# Altium schematic sheet [03] GSM_GPRS_GPS.SchDoc: GSM_GPRS_GPS
size A4
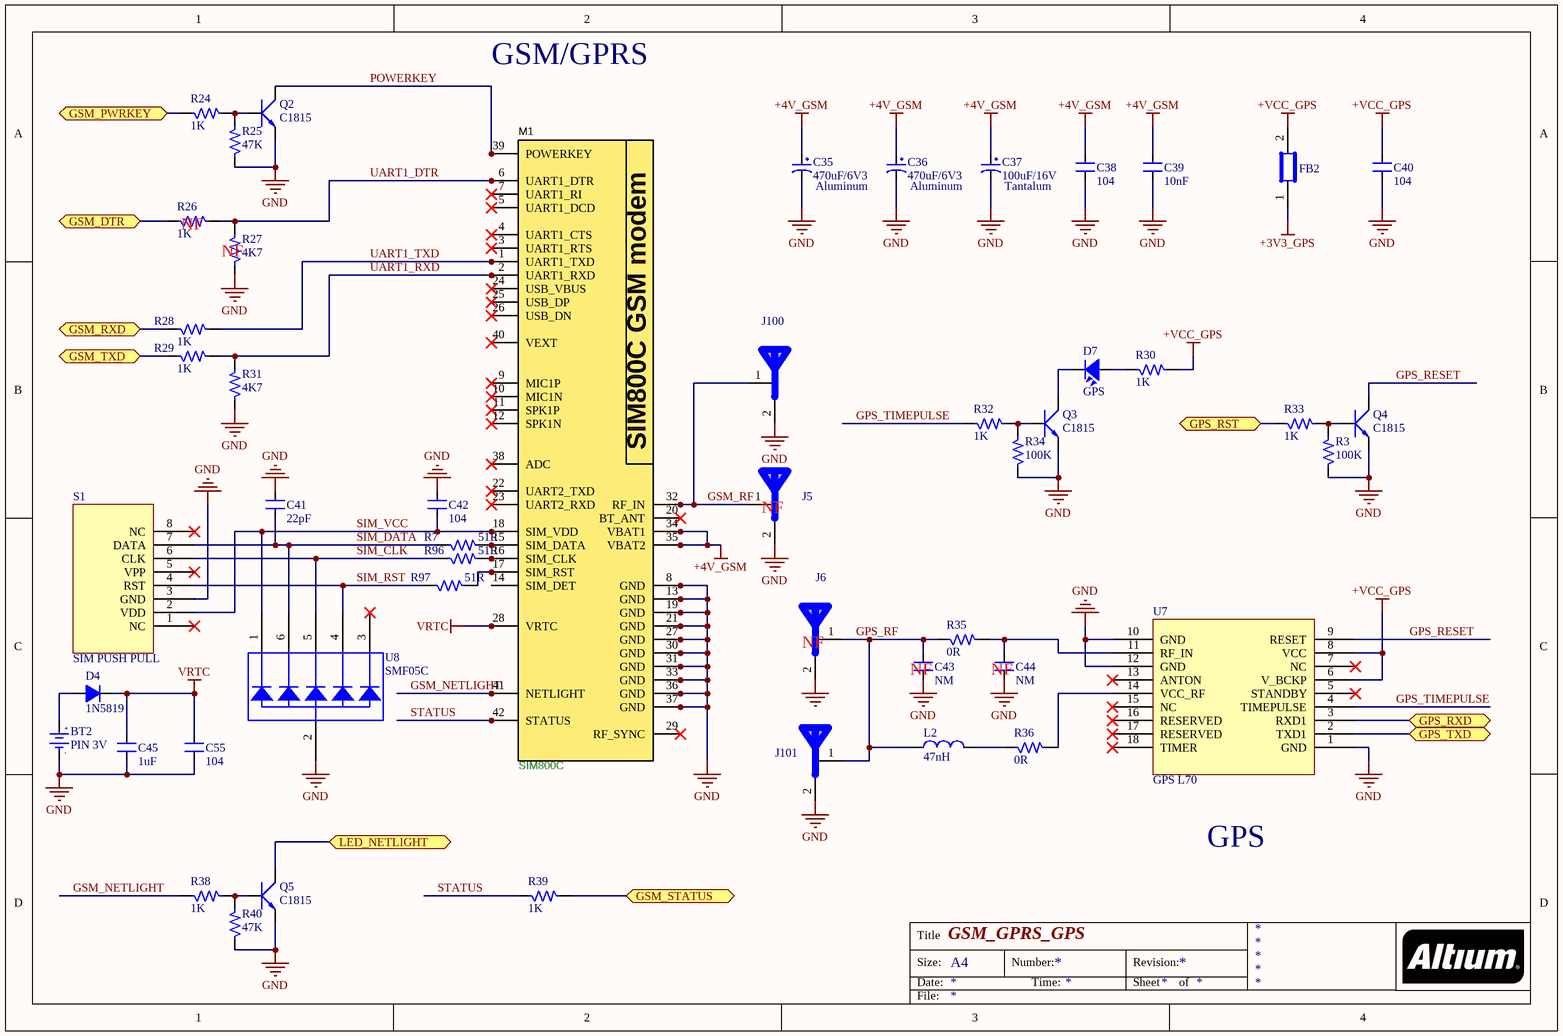
[diagram p0: [03] GSM_GPRS_GPS.SchDoc]

## Parts
BT2  PIN 3V  [PIN3V_mini]
C35  470uF/6V3  [C_Alu_6.3x7.7]
C36  470uF/6V3  [C_Alu_6.3x7.7]
C37  100uF/16V  [C_7343_40]
C38  104  [C0603 SMT]
C39  10nF  [C0603 SMT]
C40  104  [C0603 SMT]
C41  22pF  [C0603 SMT]
C42  104  [C0603 SMT]
C43  NM  [C0603 SMT]
C44  NM  [C0603 SMT]
C45  1uF  [C0603 SMT]
C55  104  [C0603 SMT]
D4  1N5819  [SOD123]
D7  GPS  [Led_0603_RED]
FB2  BLM21PG600SN1D  [R0805]  (value not drawn)
J5  GSM  [Antenna-IPEX]  (value not drawn)
J6  GPS  [Antenna-IPEX]  (value not drawn)
J100  GPS_ANTENNA  [Antenna-MCX5.08-H5]  (value not drawn)
J101  GPS_ANTENNA  [Antenna-MCX5.08-H5]  (value not drawn)
L2  47nH  [C0805]
M1  SIM800C  [SIM800C]
Q2  C1815  [SOT23B]
Q3  C1815  [SOT23B]
Q4  C1815  [SOT23B]
Q5  C1815  [SOT23B]
R3  100K  [R0603 -SMT]
R7  51R  [R0603 -SMT]
R24  1K  [R0603 -SMT]
R25  47K  [R0603 -SMT]
R26  1K  [R0603 -SMT]
R27  4K7  [R0603 -SMT]
R28  1K  [R0603 -SMT]
R29  1K  [R0603 -SMT]
R30  1K  [R0603 -SMT]
R31  4K7  [R0603 -SMT]
R32  1K  [R0603 -SMT]
R33  1K  [R0603 -SMT]
R34  100K  [R0603 -SMT]
R35  0R  [R0603 -SMT]
R36  0R  [R0603 -SMT]
R38  1K  [R0603 -SMT]
R39  1K  [R0603 -SMT]
R40  47K  [R0603 -SMT]
R96  51R  [R0603 -SMT]
R97  51R  [R0603 -SMT]
S1  SIM PUSH PULL  [Sim Push Push]
U7  GPS L70  [GPS L70]
U8  SMF05C  [SOT_363_6]

## Ports
GPS_RST, GPS_RXD, GPS_TXD, GSM_DTR, GSM_PWRKEY, GSM_RXD, GSM_STATUS, GSM_TXD, LED_NETLIGHT

## Nets
+3V3_GPS: FB2.1
+4V_GSM: C35.1 C36.1 C37.1 C38.1 C39.1 M1.34(VBAT1) M1.35(VBAT2)
+VCC_GPS: C40.2 FB2.2 R30.2 U7.6(V_BCKP) U7.8(VCC)
GND: BT2.2(GND) C35.2 C36.2 C37.2 C38.2 C39.2 C40.1 C41.2 C42.2 C43.1 C44.1 C45.1 C55.1 J5.2(GND) J6.2(GND) J100.2(GND) J101.2(GND) M1.8(GND) M1.13(GND) M1.19(GND) M1.21(GND) M1.27(GND) M1.30(GND) M1.31(GND) M1.33(GND) M1.36(GND) M1.37(GND) Q2.1(E) Q3.1(E) Q4.1(E) Q5.1(E) R3.1 R25.1 R27.1 R31.1 R34.1 R40.1 S1.3(GND) U7.1(GND) U7.10(GND) U7.12(GND) U8.2(A)
VRTC: C45.2 C55.2 D4.2(K) M1.28(VRTC)
GPS_RESET: Q4.2(C) U7.9(RESET)
GPS_RF: C43.2 J6.1(GND) J101.1(GND) L2.1 R35.1
GPS_RST: R33.1 ; port GPS_RST
GPS_RXD: U7.3(RXD1) ; port GPS_RXD
GPS_TIMEPULSE: R32.1 U7.4(TIMEPULSE)
GPS_TXD: U7.2(TXD1) ; port GPS_TXD
GSM_DTR: R26.1 ; port GSM_DTR
GSM_NETLIGHT: M1.41(NETLIGHT) R38.1
GSM_PWRKEY: R24.1 ; port GSM_PWRKEY
GSM_RF: J5.1(GND) J100.1(GND) M1.32(RF_IN)
GSM_RXD: R28.1 ; port GSM_RXD
GSM_STATUS: R39.2 ; port GSM_STATUS
GSM_TXD: R29.1 ; port GSM_TXD
LED_NETLIGHT: Q5.2(C) ; port LED_NETLIGHT
POWERKEY: M1.39(POWERKEY) Q2.2(C)
SIM_CLK: R96.1 S1.6(CLK) U8.5(K4)
SIM_DATA: C41.1 R7.1 S1.7(DATA) U8.6(K5)
SIM_RST: R97.1 S1.4(RST) U8.4(K3)
SIM_VCC: C42.1 M1.18(SIM_VDD) S1.2(VDD) U8.1(K1)
STATUS: M1.42(STATUS) R39.1
UART1_DTR: M1.6(UART1_DTR) R26.2 R27.2
UART1_RXD: M1.2(UART1_RXD) R29.2 R31.2
UART1_TXD: M1.1(UART1_TXD) R28.2
NetBT2_1: BT2.1(+3V) D4.1(A)
NetC44_2: C44.2 R35.2 U7.11(RF_IN)
NetD7_1: D7.1 R30.1
NetD7_2: D7.2 Q3.2(C)
NetL2_2: L2.2 R36.1
NetM1_15: M1.15(SIM_DATA) R7.2
NetM1_16: M1.16(SIM_CLK) R96.2
NetM1_17: M1.17(SIM_RST) R97.2
NetQ2_3: Q2.3(B) R24.2 R25.2
NetQ3_3: Q3.3(B) R32.2 R34.2
NetQ4_3: Q4.3(B) R3.2 R33.2
NetQ5_3: Q5.3(B) R38.2 R40.2
NetR36_2: R36.2 U7.14(VCC_RF)

Not connected (* = marked no-connect by the designer): M1 3(UART1_RTS)* 4(UART1_CTS)* 5(UART1_DCD)* 7(UART1_RI)* 9(MIC1P)* 10(MIC1N)* 11(SPK1P)* 12(SPK1N)* 14(SIM_DET) 20(BT_ANT)* 22(UART2_TXD)* 23(UART2_RXD)* 24(USB_VBUS)* 25(USB_DP)* 26(USB_DN)* 29(RF_SYNC)* 38(ADC)* 40(VEXT)*; S1 1(NC)* 5(VPP)* 8(NC)*; U7 5(STANDBY)* 7(NC)* 13(ANTON)* 15(NC)* 16(RESERVED)* 17(RESERVED)* 18(TIMER)*; U8 3(K2)*

## Notes on the sheet
- GSM/GPRS
- (near R26) NF
- (near C35) Aluminum
- (near C36) Aluminum
- (near C37) Tantalum
- (near R27) NF
- (near J5) NF
- (near J6) NF
- (near C43) NF
- (near C44) NF
- GPS
- Title
- Size:
- Date:
- A4
- Number:
- Time:
- Revision:
- Sheet
- of
- File:
- (in symbol PIN 3V) +; -
- (in symbol SIM800C) SIM800C GSM modem

## Library data of the parts
BT2 = PIN 3V: Battery 3VDC; Value: PIN 3V
C35 C36 = C-Alu-Tantalum: Cap Aluminum; Value: 10uF/50V; Description 1: 10 => 220uF/6,3V/10V - 10uF => 100uF/16V; Description 2: 0,1uF => 33uF/50V - 10uF => 22uF/63V; Description 3: 0,47uF => 10uF/100V
C37 = C-Alu-Tantalum: Cap Tantalum 7343; Value: 10uF/50V; Description 1: 10 => 220uF/6,3V/10V - 10uF => 100uF/16V; Description 2: 0,1uF => 33uF/50V - 10uF => 22uF/63V; Description 3: 0,47uF => 10uF/100V
C38-C45 C55 = CM: Cap SMD; Value: 103
D4 = D1A: Diode 1A; Value: 1N4007
D7 = LED: LED Single colour Green and Red; Value: LED 3 ly Single Colour
FB2 = Ferrite Bead
J5 J6 J100 J101 = ANTEN
L2 = L1: Inductor; Value: 150 mH
Q2-Q5 = C1815: NPN 600mW, ECB; Value: C1815
R3 R7 R25 R27 R31 R34-R36 R40 R96 R97 = RM: Resistor SMD; Value: 1K
R24 R26 R28-R30 R32 R33 R38 R39 = RM: Resistor SMD; Value: 1K
S1 = SIM SOCKET PUSH PULL
U8 = SMF05C: ESD Protection